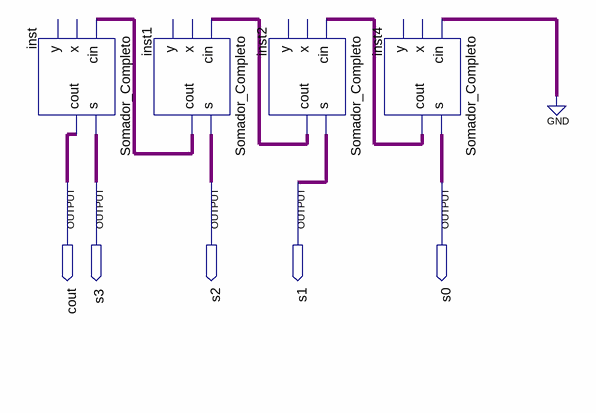
[diagram p0: schematic sheet]
// Quartus schematic Somador_4_Bits.bdf as structural Verilog: 4 symbols, 5 pins
module Somador_4_Bits (
  output cout,
  output s3,
  output s2,
  output s1,
  output s0
);

  wire inst1_cout, inst2_cout, inst4_cout;

  Somador_Completo inst (.cin(inst1_cout), .s(s3), .cout(cout));  // open: x, y
  Somador_Completo inst1 (.cin(inst2_cout), .s(s2), .cout(inst1_cout));  // open: x, y
  Somador_Completo inst2 (.cin(inst4_cout), .s(s1), .cout(inst2_cout));  // open: x, y
  Somador_Completo inst4 (.cin(1'b0), .s(s0), .cout(inst4_cout));  // open: x, y
endmodule
